# Altium schematic sheet tube-driver.SchDoc
size B; SheetNumber: 8; SheetTotal: 9
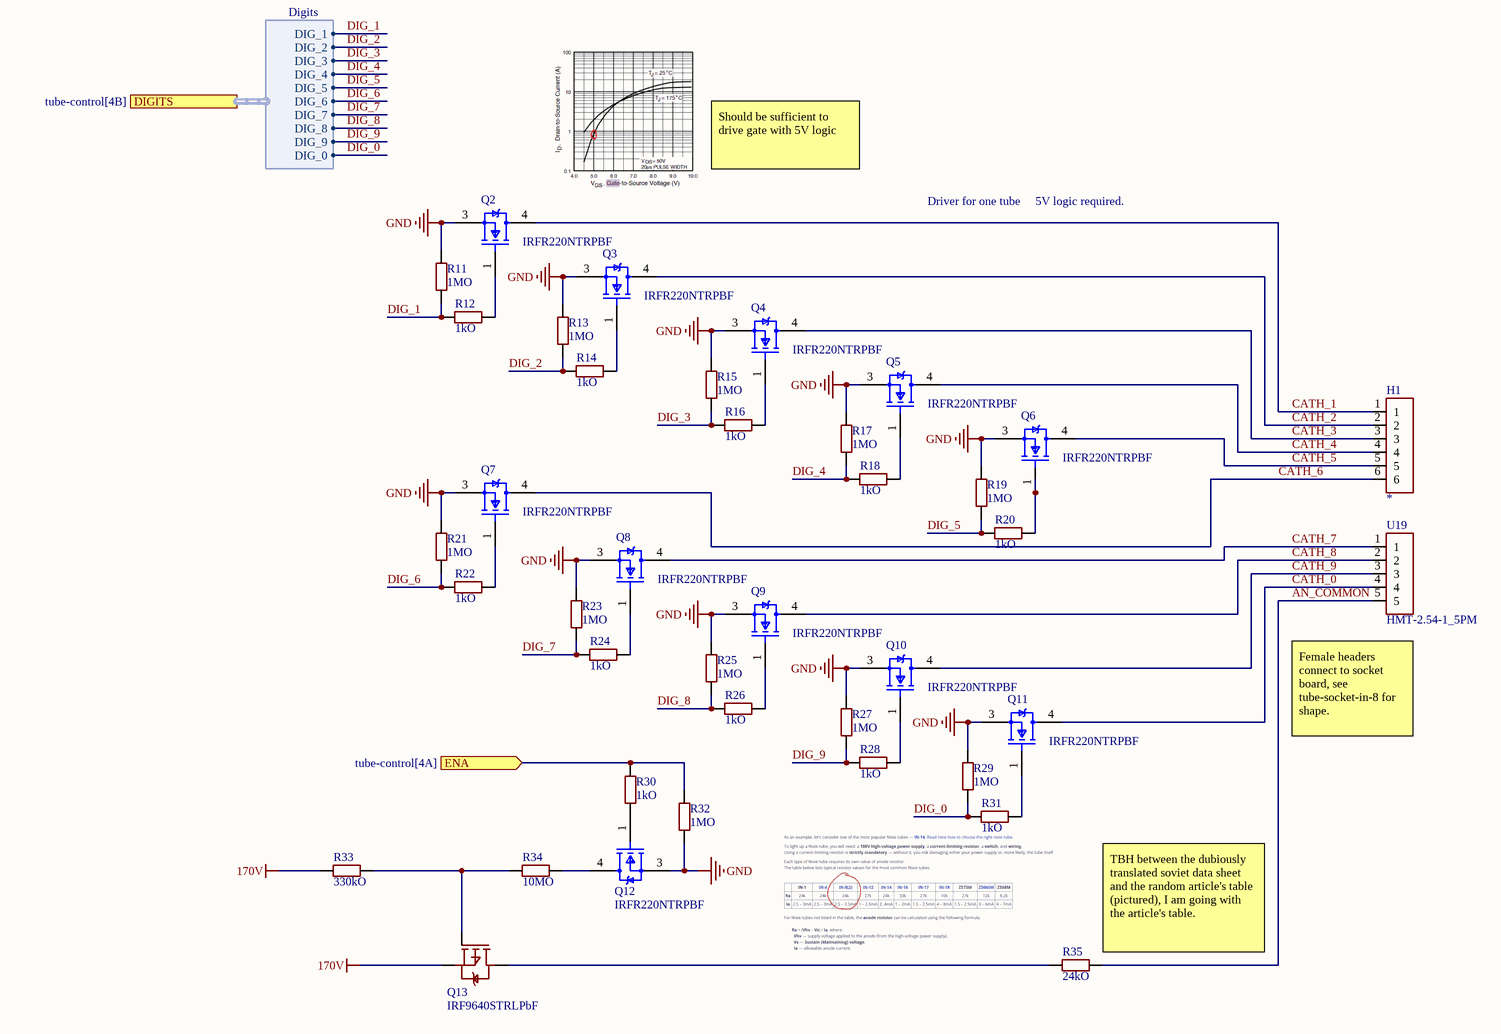
[diagram p0: tube-driver.SchDoc]

## Parts
H1  2.54-1_6P  [2.54-1_6P]  (value not drawn)
Q2  IRFR220NTRPBF  [FP-PG-TO252-3-MFG]
Q3  IRFR220NTRPBF  [FP-PG-TO252-3-MFG]
Q4  IRFR220NTRPBF  [FP-PG-TO252-3-MFG]
Q5  IRFR220NTRPBF  [FP-PG-TO252-3-MFG]
Q6  IRFR220NTRPBF  [FP-PG-TO252-3-MFG]
Q7  IRFR220NTRPBF  [FP-PG-TO252-3-MFG]
Q8  IRFR220NTRPBF  [FP-PG-TO252-3-MFG]
Q9  IRFR220NTRPBF  [FP-PG-TO252-3-MFG]
Q10  IRFR220NTRPBF  [FP-PG-TO252-3-MFG]
Q11  IRFR220NTRPBF  [FP-PG-TO252-3-MFG]
Q12  IRFR220NTRPBF  [FP-PG-TO252-3-MFG]
Q13  IRF9640STRLPbF  [IRF9640STRLPbF]
R11  value 1MO  [0402WGF1004TCE]  (hidden comment: 0402WGF1004TCE)
R12  value 1kO  [0402WGF1001TCE]  (hidden comment: 0402WGF1001TCE)
R13  value 1MO  [0402WGF1004TCE]  (hidden comment: 0402WGF1004TCE)
R14  value 1kO  [0402WGF1001TCE]  (hidden comment: 0402WGF1001TCE)
R15  value 1MO  [0402WGF1004TCE]  (hidden comment: 0402WGF1004TCE)
R16  value 1kO  [0402WGF1001TCE]  (hidden comment: 0402WGF1001TCE)
R17  value 1MO  [0402WGF1004TCE]  (hidden comment: 0402WGF1004TCE)
R18  value 1kO  [0402WGF1001TCE]  (hidden comment: 0402WGF1001TCE)
R19  value 1MO  [0402WGF1004TCE]  (hidden comment: 0402WGF1004TCE)
R20  value 1kO  [0402WGF1001TCE]  (hidden comment: 0402WGF1001TCE)
R21  value 1MO  [0402WGF1004TCE]  (hidden comment: 0402WGF1004TCE)
R22  value 1kO  [0402WGF1001TCE]  (hidden comment: 0402WGF1001TCE)
R23  value 1MO  [0402WGF1004TCE]  (hidden comment: 0402WGF1004TCE)
R24  value 1kO  [0402WGF1001TCE]  (hidden comment: 0402WGF1001TCE)
R25  value 1MO  [0402WGF1004TCE]  (hidden comment: 0402WGF1004TCE)
R26  value 1kO  [0402WGF1001TCE]  (hidden comment: 0402WGF1001TCE)
R27  value 1MO  [0402WGF1004TCE]  (hidden comment: 0402WGF1004TCE)
R28  value 1kO  [0402WGF1001TCE]  (hidden comment: 0402WGF1001TCE)
R29  value 1MO  [0402WGF1004TCE]  (hidden comment: 0402WGF1004TCE)
R30  value 1kO  [0402WGF1001TCE]  (hidden comment: 0402WGF1001TCE)
R31  value 1kO  [0402WGF1001TCE]  (hidden comment: 0402WGF1001TCE)
R32  value 1MO  [0402WGF1004TCE]  (hidden comment: 0402WGF1004TCE)
R33  value 330kO  [0603WAF3303T5E]  (hidden comment: 0603WAF3303T5E)
R34  value 10MO  [0603WAF1005T5E]  (hidden comment: 0603WAF1005T5E)
R35  value 24kO  [0603WAF2402T5E]  (hidden comment: 0603WAF2402T5E)
U19  HMT-2.54-1_5PM  [HMT-2.54-1_5PM]

## Ports
DIGITS (harness Digits, see tube-control[4B]), ENA (in, see tube-control[4A])

## Harnesses
Digits: DIG_1, DIG_2, DIG_3, DIG_4, DIG_5, DIG_6, DIG_7, DIG_8, DIG_9, DIG_0

## Nets
170V: Q13.3(S) R33.1
GND: Q2.3(SOURCE) Q3.3(SOURCE) Q4.3(SOURCE) Q5.3(SOURCE) Q6.3(SOURCE) Q7.3(SOURCE) Q8.3(SOURCE) Q9.3(SOURCE) Q10.3(SOURCE) Q11.3(SOURCE) Q12.3(SOURCE) R11.2 R13.2 R15.2 R17.2 R19.2 R21.2 R23.2 R25.2 R27.2 R29.2 R32.1
AN_COMMON: R35.2 U19.5
CATH_0: Q11.4(DRAIN) U19.4
CATH_1: H1.1 Q2.4(DRAIN)
CATH_2: H1.2 Q3.4(DRAIN)
CATH_3: H1.3 Q4.4(DRAIN)
CATH_4: H1.4 Q5.4(DRAIN)
CATH_5: H1.5 Q6.4(DRAIN)
CATH_6: H1.6 Q7.4(DRAIN)
CATH_7: Q8.4(DRAIN) U19.1
CATH_8: Q9.4(DRAIN) U19.2
CATH_9: Q10.4(DRAIN) U19.3
DIG_0: R29.1 R31.1 ; port DIGITS.DIG_0
DIG_1: R11.1 R12.1 ; port DIGITS.DIG_1
DIG_2: R13.1 R14.1 ; port DIGITS.DIG_2
DIG_3: R15.1 R16.1 ; port DIGITS.DIG_3
DIG_4: R17.1 R18.1 ; port DIGITS.DIG_4
DIG_5: R19.1 R20.1 ; port DIGITS.DIG_5
DIG_6: R21.1 R22.1 ; port DIGITS.DIG_6
DIG_7: R23.1 R24.1 ; port DIGITS.DIG_7
DIG_8: R25.1 R26.1 ; port DIGITS.DIG_8
DIG_9: R27.1 R28.1 ; port DIGITS.DIG_9
ENA: R30.2 R32.2 ; port ENA
NetQ2_1: Q2.1(GATE) R12.2
NetQ3_1: Q3.1(GATE) R14.2
NetQ4_1: Q4.1(GATE) R16.2
NetQ5_1: Q5.1(GATE) R18.2
NetQ6_1: Q6.1(GATE) R20.2
NetQ7_1: Q7.1(GATE) R22.2
NetQ8_1: Q8.1(GATE) R24.2
NetQ9_1: Q9.1(GATE) R26.2
NetQ10_1: Q10.1(GATE) R28.2
NetQ11_1: Q11.1(GATE) R31.2
NetQ12_1: Q12.1(GATE) R30.1
NetQ12_4: Q12.4(DRAIN) R34.2
NetQ13_1: Q13.1(G) R33.2 R34.1
NetQ13_4: Q13.4(D) R35.1

## Notes on the sheet
- Should be sufficient to drive gate with 5V logic
- Driver for one tube
- 5V logic required.
- (near U19) Female headers connect to socket board, see tube-socket-in-8 for shape.
- (near R35) TBH between the dubiously translated soviet data sheet and the random article's table (pictured), I am going with the article's table.

## Library data of the parts
H1 = 2.54-1_6P: Pin Headers. -40C~+105C 1 1x6P 2.54mm 3.3mm 3A 6P Brass Square Hole Through Hole Top ,P=2.54mm Female Headers ROHS; Manufacturer Part Number: 2.54-1*6P; Manufacturer: BOOMELE(Boom Precision Elec); Component Type: Connectors; Design Item ID: 2.54-1_6P; Value: *; JLCPCB Part #: C40877
Q2-Q12 = CMP-32901-000070-1: MOSFET N-CH 200V 5A DPAK; Manufacturer: Infineon; Gate Charge At Vgs: 15nC @ 10V; Rthja Max: 110°C/W; Gate To Source Voltage: 20V; Pulse Drain Current: 20A; Threshold Vgs Max: 4V; Max Junction Temp: +175°C; Drain To Source Resistance: 600mΩ; Number Of N Channels: 1; Depletion Mode: False; Max Forward Diode Voltage: 1.3V; Turn On Delay Time: 6.4ns; Power Dissipation: 43W; Reverse Recovery Time: 90ns; Threshold Vgs Min: 2V; Reverse Recovery Charge: 320nC; Turn Off Delay Time: 20ns; Input Capacitace At Vds: 300pF @ 25V; Package: PG-TO252-3; Height: 2.52mm; RoHS: TRUE; Device Class L2: Transistors; Octopart: https://octopart.com/irfr220ntrpbf-infineon-65874086; Manufacturer Part Number: IRFR220NTRPBF; Digikey Description: MOSFET N-CH 200V 5A DPAK; ComponentLink2Description: Datasheet; Temperature Range Low: -55°C; Footprint Url: http://www.irf.com/package/hexfet/dpakfootprint.pdf; Device Class L1: Discrete Semiconductors; Continuous Drain Current: 5A; Category: Trans; Drain To Source Breakdown Voltage: 200V; Automotive: No; Lead Free: Yes; Drain To Source Voltage: 200V; Temperature Range High: +175°C; Device Class L3: MOSFETs; Number Of Channels: 1; ComponentLink2URL: https://www.infineon.com/dgdl/irfr220npbf.pdf?fileId=5546d462533600a40153562d8a7b206f; Temperature: -55°C to +175°C
Q13 = IRF9640STRLPbF: MOSFETs. -55C~+150C 1 P-Channel 1.2nF 125W 200V 370pF 44nC@10V 4V 500mohm@10V 6.8A 81pF P-Channel TO-263(D2PAK) MOSFETs ROHS; Manufacturer: Vishay Intertech; Component Type: Transistors; Design Item ID: IRF9640STRLPbF; Value: IRF9640STRLPbF; JLCPCB Part #: C2629; Manufacturer Part Number: IRF9640STRLPbF
R11 R13 R15 R17 R19 R21 R23 R25 R27 R29 R32 = 0402WGF1004TCE: Resistors. -55C~+155C 1Mohm 50V 62.5mW Thick Film Resistor +/-1% +/-100ppm/C 0402 Chip Resistor - Surface Mount ROHS; Manufacturer: UNI-ROYAL(Uniroyal Elec); Component Type: Resistors; Design Item ID: 0402WGF1004TCE; JLCPCB Part #: C26083; Manufacturer Part Number: 0402WGF1004TCE
R12 R14 R16 R18 R20 R22 R24 R26 R28 R30 R31 = 0402WGF1001TCE: Resistors. -55C~+155C 1kohm 50V 62.5mW Thick Film Resistor +/-1% +/-100ppm/C 0402 Chip Resistor - Surface Mount ROHS; Manufacturer: UNI-ROYAL(Uniroyal Elec); Component Type: Resistors; Design Item ID: 0402WGF1001TCE; JLCPCB Part #: C11702; Manufacturer Part Number: 0402WGF1001TCE
R33 = 0603WAF3303T5E: Resistors. -55C~+155C 100mW 330kohm 75V Thick Film Resistor +/-1% +/-100ppm/C 0603 Chip Resistor - Surface Mount ROHS; Manufacturer: UNI-ROYAL(Uniroyal Elec); Component Type: Resistors; Design Item ID: 0603WAF3303T5E; JLCPCB Part #: C23137; Manufacturer Part Number: 0603WAF3303T5E
R34 = 0603WAF1005T5E: Resistors. -55C~+155C 100mW 10Mohm 75V Thick Film Resistor +/-1% +/-100ppm/C 0603 Chip Resistor - Surface Mount ROHS; Manufacturer: UNI-ROYAL(Uniroyal Elec); Component Type: Resistors; Design Item ID: 0603WAF1005T5E; JLCPCB Part #: C7250; Manufacturer Part Number: 0603WAF1005T5E
R35 = 0603WAF2402T5E: Resistors. -55C~+155C 100mW 24kohm 75V Thick Film Resistor +/-1% +/-100ppm/C 0603 Chip Resistor - Surface Mount ROHS; Manufacturer: UNI-ROYAL(Uniroyal Elec); Component Type: Resistors; Design Item ID: 0603WAF2402T5E; JLCPCB Part #: C23352; Manufacturer Part Number: 0603WAF2402T5E
U19 = HMT-2.54-1_5PM: Female Headers. -40C~+105C 1 1x5P 2.54mm 2.54mm 3.2mm 3A 5P 8.5mm Brass Gold Square Hole Through Hole Top ,P=2.54mm Female Headers ROHS; Manufacturer Part Number: HMT-2.54-1*5PM; Manufacturer: HMTCONN; Component Type: Integrated Circuits; Design Item ID: HMT-2.54-1_5PM; Value: *; JLCPCB Part #: C54620386